# Altium schematic sheet CH32V003F4P6_Dev_Kit_DIY_V1.0.SchDoc
size A3; ApprovedBy: Nhatkhongbuon; Author: Nhatkhongbuon; Organization: My Company; Address1: Address Line 1; Address2: Address Line 2; Address3: Address Line 3; Address4: Address Line 4; SheetNumber: 1; SheetTotal: 1
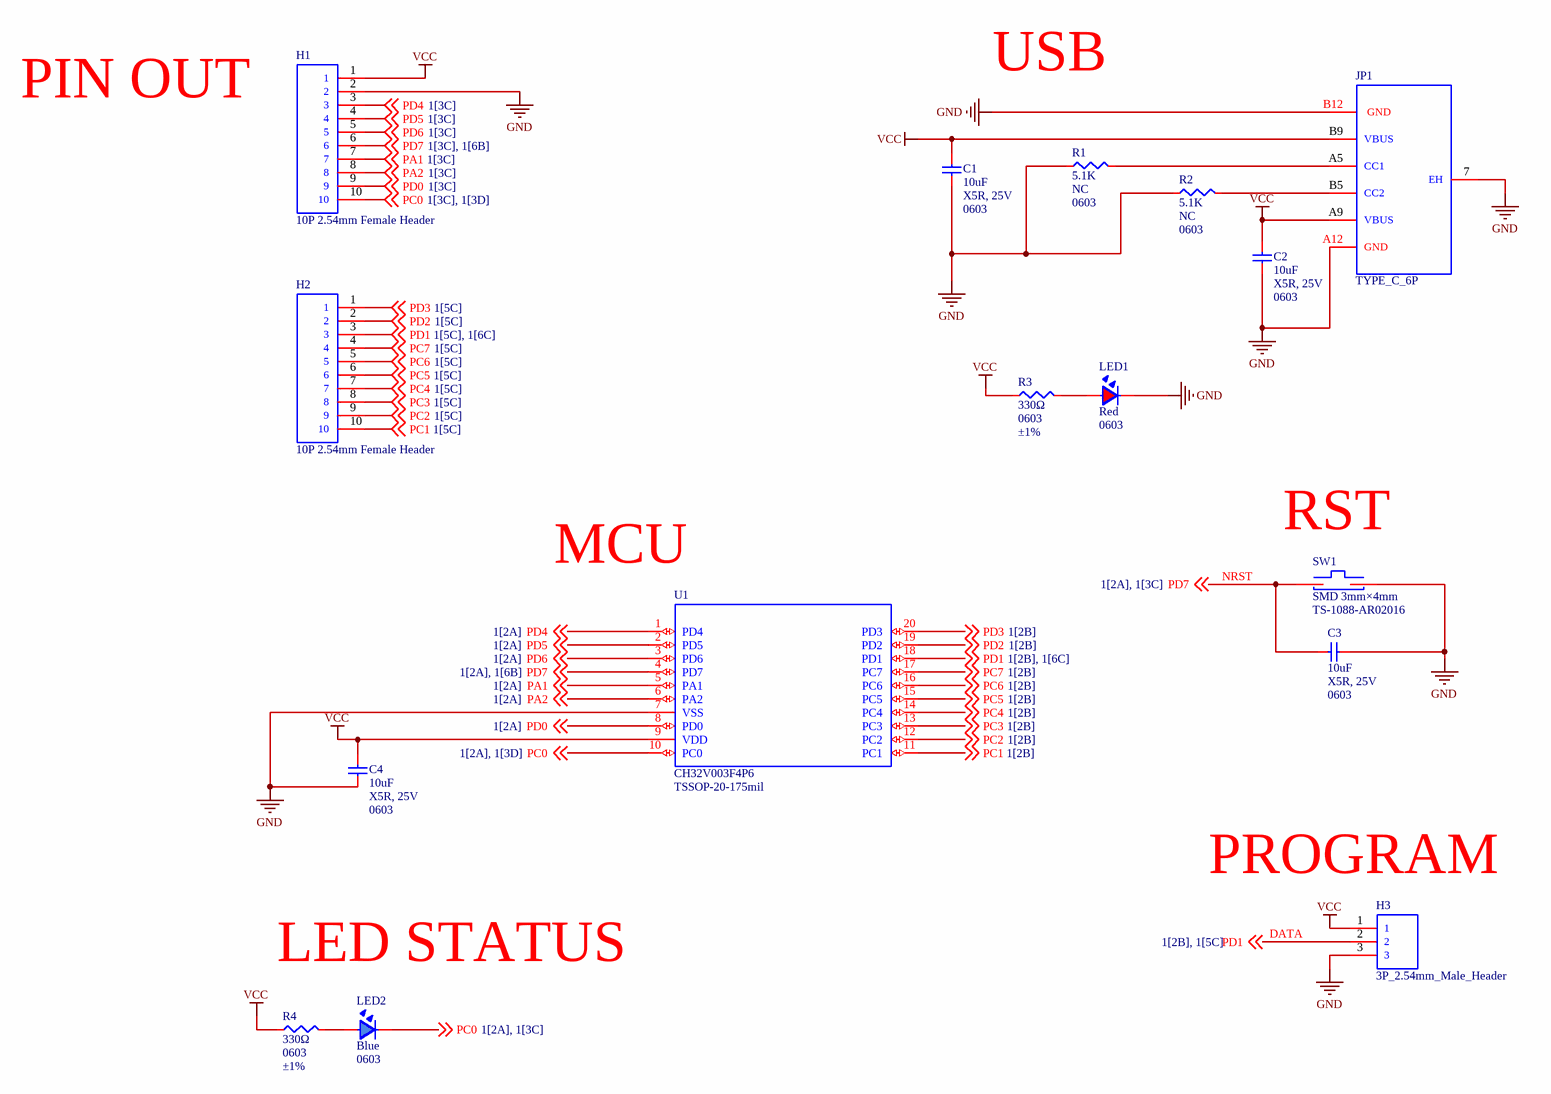
[diagram p0: CH32V003F4P6_Dev_Kit_DIY_V1.0.SchDoc]

## Parts
C1  10uF  Temperature Coefficient: X5R, 25V  Package: 0603  [C0603]
C2  10uF  Temperature Coefficient: X5R, 25V  Package: 0603  [C0603]
C3  10uF  Temperature Coefficient: X5R, 25V  Package: 0603  [C0603]
C4  10uF  Temperature Coefficient: X5R, 25V  Package: 0603  [C0603]
H1  10P 2.54mm Female Header  [10P, 2,54mm, FEMALE HEADER]
H2  10P 2.54mm Female Header  [10P, 2,54mm, FEMALE HEADER]
H3  3P_2.54mm_Male_Header  [3P_2.54mm_Male_Header]
JP1  TYPE_C_6P  [TYPE_C_6P]
LED1  Red  Package: 0603  [LED0603_RED]
LED2  Blue  Package: 0603  [LED0603_BLUE]
R1  5.1K  Status: NC  Package: 0603  [R0603 - NC]
R2  5.1K  Status: NC  Package: 0603  [R0603 - NC]
R3  330Ω  Package: 0603  Tolerance: ±1%  [R0603]
R4  330Ω  Package: 0603  Tolerance: ±1%  [R0603]
SW1  SMD 3mm×4mm  Mfr. Part: TS-1088-AR02016  [ROUND_BUTTON_SMD 3*4mm]
U1  CH32V003F4P6  Package: TSSOP-20-175mil  [TSSOP-20]

## Nets
GND: C1.2 C2.1 C3.2 C4.1 H1.2 H3.3 JP1.7(EH) JP1.A12(GND) JP1.B12(GND) LED1.2 R1.1 R2.1 SW1.2 U1.7(VSS)
VCC: C1.1 C2.2 C4.2 H1.1 H3.1 JP1.A9(VBUS) JP1.B9(VBUS) R3.1 R4.1 U1.9(VDD)
PA1: H1.7 U1.5(PA1) ; off-sheet PA1
PA2: H1.8 U1.6(PA2) ; off-sheet PA2
PC0: H1.10 LED2.2 U1.10(PC0) ; off-sheet PC0
PC1: H2.10 U1.11(PC1) ; off-sheet PC1
PC2: H2.9 U1.12(PC2) ; off-sheet PC2
PC3: H2.8 U1.13(PC3) ; off-sheet PC3
PC4: H2.7 U1.14(PC4) ; off-sheet PC4
PC5: H2.6 U1.15(PC5) ; off-sheet PC5
PC6: H2.5 U1.16(PC6) ; off-sheet PC6
PC7: H2.4 U1.17(PC7) ; off-sheet PC7
PD0: H1.9 U1.8(PD0) ; off-sheet PD0
PD1: H2.3 H3.2 U1.18(PD1) ; off-sheet PD1
PD2: H2.2 U1.19(PD2) ; off-sheet PD2
PD3: H2.1 U1.20(PD3) ; off-sheet PD3
PD4: H1.3 U1.1(PD4) ; off-sheet PD4
PD5: H1.4 U1.2(PD5) ; off-sheet PD5
PD6: H1.5 U1.3(PD6) ; off-sheet PD6
PD7: C3.1 H1.6 SW1.1 U1.4(PD7) ; off-sheet PD7
NetJP1_A5: JP1.A5(CC1) R1.2
NetJP1_B5: JP1.B5(CC2) R2.2
NetLED1_1: LED1.1 R3.2
NetLED2_1: LED2.1 R4.2

## Notes on the sheet
- PIN OUT
- USB
- MCU
- NRST
- (near SW1) RST
- (near H3) PROGRAM
- LED STATUS
- DATA
- Author:
- Title:
- Size:
- A3
- Project:
- Revision:
- Modified Date:
- CheckedBy:
- Date:
- SW Version:

## Library data of the parts
C1-C4 = C0603_MLCC_10uF_X5R_25V: 25V 10uF X5R ±20% 0603 Multilayer Ceramic Capacitors MLCC - SMD/SMT ROHS; Manufacturer: YAGEO; Mfr. Part: CC0603MRX5R8BB106; LCSC Part: C596327; Capacitance: 10uF; Link: https://www.lcsc.com/product-detail/C596327.html; Tolerance: ±20%; Voltage Rating: 25V
H1 H2 = 10P 2.54mm Female Header: 2.54mm 1 8P Through Hole 1x8P Through Hole,P=2.54mm Female Headers ROHS; Manufacturer: ZHOURI; Mfr. Part: PM2.54-1*10; Holes Structure: 1x10P; LCSC Part: C5116489; Package: Through Hole,P=2.54mm; Link: https://www.lcsc.com/product-detail/C5116489.html; Pitch: 2.54mm
H3 = 3P_2.54mm_Male_Header: 250V 3A Through Hole Pin Header 2.5mm 3P 6mm -40℃~+105℃ 3mm 2.54mm 1 Black 1x3P Through Hole,P=2.54mm Pin Headers ROHS; Manufacturer: XFCN; Mfr. Part: PZ254V-11-03P; LCSC Part: C2937625; Package: Through Hole,P=2.54mm; Number of Pins: 3P; Voltage Rating (Max): 250V; Current Rating: 3A; Link: https://www.lcsc.com/product-detail/C2937625.html
JP1 = TYPE_C_6P: 3A USB 3.1 1 Surface Mount, Right Angle 6P Female -40℃~+85℃ Type-C SMD USB Connectors ROHS; Manufacturer: SHOU HAN; Mfr. Part: TYPE-C 6P; Key Attributes: CONN RCPT USB 3.1 Type-C 6POS SMD R/A; Protocol Standard: USB 3.1; Voltage Rating: 5V; LCSC Part: C456012; Package: SMD; Current Rating-Power: 3A; Number of Contacts: 6P; Link: https://www.lcsc.com/product-detail/C456012.html?s_z=n_typec%25206p
LED1 = LED0603_Red: 20mA 230mcd Water Clear -40℃~+85℃ 630nm Red 120° 75mW 1.95V 0603 LED Indication - Discrete ROHS; Manufacturer: Kingbright; Mfr. Part: APT1608SURCK; Key Attributes: 1.6 x 0.8 mm SMD Chip LED Lamp; LCSC Part: C5875723; Illumination Color: Red; Power(Watts): 75mW; Voltage - Forward(Vf): 1.95V; Forward Current: 20mA; Operating Temperature: -40℃~+85℃; Link: https://www.lcsc.com/product-detail/C5875723.html
LED2 = LED0603_Blue: 2mA 24mcd Water Clear -40℃~+85℃ 470nm Blue 130° 120mW 2.65V 0603 LED Indication - Discrete ROHS; Manufacturer: Kingbright; Mfr. Part: APT1608LVBC/D; Key Attributes: 1.6 x 0.8 mm SMD Chip LED Lamp; LCSC Part: C5200747; Illumination Color: Blue; Power(Watts): 120mW; Voltage - Forward(Vf): 2.65V; Forward Current: 2mA; Operating Temperature: -40℃~+85℃; Link: https://www.lcsc.com/product-detail/C5200747.html
R1 R2 = R0603_NC
R3 R4 = R0603_330Ω_±1%: 100mW Thick Film Resistor 75V ±100ppm/℃ ±1% 330Ω 0603 Chip Resistor - Surface Mount ROHS; Manufacturer: YAGEO; Mfr. Part: RC0603FR-07330RL; LCSC Part: C105881; Resistance: 330Ω; Operating Temperature: -55℃~+155℃; Link: https://www.lcsc.com/product-detail/C105881.html
SW1 = SW_BUTTON_SMD_3mm×4mm: Without Bracket 50mA 4mm 100,000 Cycles 12V 1.6N 3mm 2mm Round Button Surface Mount,Vertical SPST SMD Tactile Switches ROHS; Manufacturer: XUNPU; LCSC Part: C720477; Package: SMD; Length: 4mm; Width: 3mm; Voltage Rating: 12V; Operating Temperature: -30℃~+80℃; Link: https://www.lcsc.com/product-detail/C720477.html?s_z=n_Button
U1 = CH32V003F4P6_TSSOP-20-175mil: TSSOP-20-175mil Microcontrollers (MCU/MPU/SOC) ROHS; Manufacturer: WCH; Mfr. Part: CH32V003F4P6; LCSC Part: C5187096; Link: https://www.lcsc.com/product-detail/C5187096.html?s_z=n_CH32V003F4P6